# EAGLE design LAMEBOY (EAGLE 7.6.0)

## Sheet 1 of 2
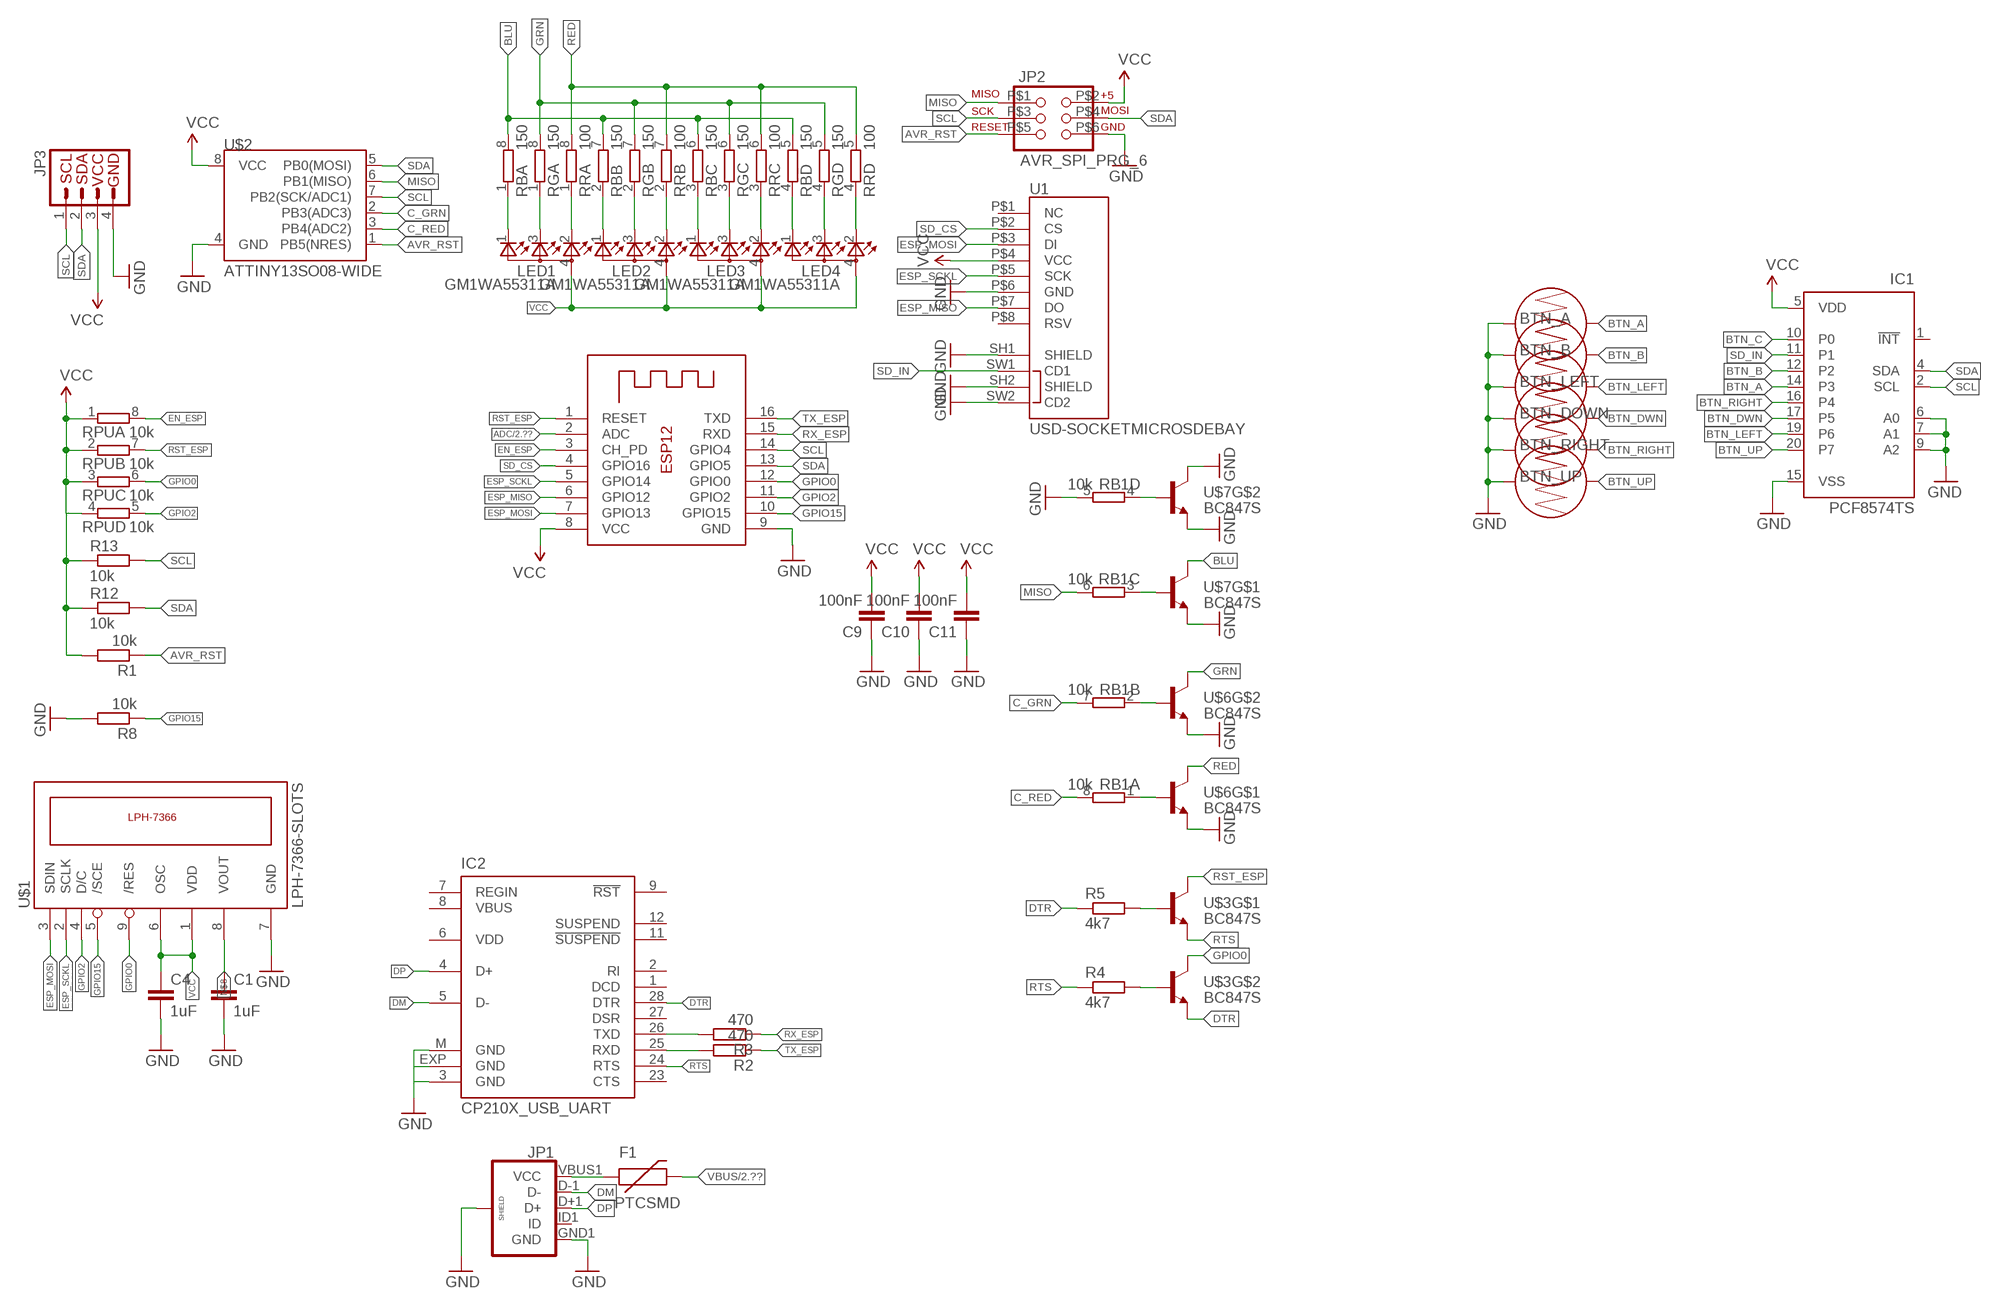
[diagram p0: schematic, sheet 1]

### Parts
BTN_A  BUTTON-CONDUCTIVESMD  [BUTTON-CONDUCTIVE]
BTN_B  BUTTON-CONDUCTIVESMD  [BUTTON-CONDUCTIVE]
BTN_DOWN  BUTTON-CONDUCTIVESMD  [BUTTON-CONDUCTIVE]
BTN_LEFT  BUTTON-CONDUCTIVESMD  [BUTTON-CONDUCTIVE]
BTN_RIGHT  BUTTON-CONDUCTIVESMD  [BUTTON-CONDUCTIVE]
BTN_UP  BUTTON-CONDUCTIVESMD  [BUTTON-CONDUCTIVE]
C1  1uF  C-EUC0805  [C0805]
C4  1uF  C-EUC0805  [C0805]
C9  100nF  C-EUC0805  [C0805]
C10  100nF  C-EUC0805  [C0805]
C11  100nF  C-EUC0805  [C0805]
F1  PTCSMD  [PTC-1206]
IC1  PCF8574TS  [SSOP20]
IC2  CP210X_USB_UART  [MLP28]
JP1  USB_MICROB_PLUG-IDK  [USB-AB-MICRO-SMD_SLOT]
JP2  AVR_SPI_PRG_6  [2X3_SMD_PAD]
JP3  I2C_STANDARDI2C_JST  [S4B-PH]
LED1  GM1WA55311A  [GM1WA55311A]
LED2  GM1WA55311A  [GM1WA55311A]
LED3  GM1WA55311A  [GM1WA55311A]
LED4  GM1WA55311A  [GM1WA55311A]
R1  10k  R-EU_R0805  [R0805]
R2  470  R-EU_R0805  [R0805]
R3  470  R-EU_R0805  [R0805]
R4  4k7  R-EU_R0805  [R0805]
R5  4k7  R-EU_R0805  [R0805]
R8  10k  R-EU_R0805  [R0805]
R12  10k  R-EU_R0805  [R0805]
R13  10k  R-EU_R0805  [R0805]
RB  150  4R-N0603-ARC  [0603-ARC]
RB1  10k  4R-N0603-ARC  [0603-ARC]
RG  150  4R-N0603-ARC  [0603-ARC]
RPU  10k  4R-N0603-ARC  [0603-ARC]
RR  100  4R-N0603-ARC  [0603-ARC]
U1  USD-SOCKETMICROSDEBAY  [MICRO-SD-SOCKET-EBAY]
U$1  LPH-7366-SLOTS  [LPH-7366-SLOTS]
U$2  ATTINY13SO08-WIDE  [SO08-EIAJ]
U$3  BC847S  MMDT3904  [SOT363]
U$6  BC847S  MMDT3904  [SOT363]
U$7  BC847S  MMDT3904  [SOT363]
X1  ESP-12  [ESP-12]

### Nets
ADC: X1.2(ADC) ; also sheet 2
AVR_RST: JP2.P$5 R1.1 U$2.1(PB5(NRES))
BLU: RB.5 RB.6 RB.7 RB.8 U$7.3(C)
BLUE_LED: LED4.1(CGREEN) RB.4
BTN_A: BTN_A.2 IC1.14(P3)
BTN_B: BTN_B.2 IC1.12(P2)
BTN_C: IC1.10(P0)
BTN_DWN: BTN_DOWN.2 IC1.17(P5)
BTN_LEFT: BTN_LEFT.2 IC1.19(P6)
BTN_RIGHT: BTN_RIGHT.2 IC1.16(P4)
BTN_UP: BTN_UP.2 IC1.20(P7)
C_GRN: RB1.7 U$2.2(PB3(ADC3))
C_RED: RB1.8 U$2.3(PB4(ADC2))
DM: IC2.5(D-) JP1.D-1(D-)
DP: IC2.4(D+) JP1.D+1(D+)
DTR: IC2.28(DTR) R5.1 U$3.1(E)
EN_ESP: RPU.8 X1.3(CH_PD)
ESP_MISO: U1.P$7(DO) X1.6(GPIO12)
ESP_MOSI: U1.P$3(DI) U$1.3(SDIN) X1.7(GPIO13)
ESP_SCKL: U1.P$5(SCK) U$1.2(SCLK) X1.5(GPIO14)
GND: BTN_A.1 BTN_B.1 BTN_DOWN.1 BTN_LEFT.1 BTN_RIGHT.1 BTN_UP.1 C1.2 C4.2 C9.1 C10.1 C11.1 IC1.6(A0) IC1.7(A1) IC1.9(A2) IC1.15(VSS) IC2.3(GND) IC2.EXP(GND) IC2.M(GND) JP1.GND1(GND) JP1.P$1(SHIELD) JP1.P$2(SHIELD) JP1.P$3(SHIELD) JP1.P$4(SHIELD) JP2.P$6 JP3.4 R8.2 RB1.5 U1.P$6(GND) U1.SH1(SHIELD) U1.SH2(SHIELD) U1.SW2(CD2) U$1.7(GND) U$2.4(GND) U$6.1(E) U$6.4(E) U$7.1(E) U$7.4(E) U$7.6(C) X1.9(GND) ; also sheet 2
GPIO0: RPU.6 U$1.9(/RES) U$3.6(C) X1.12(GPIO0)
GPIO2: RPU.5 U$1.4(D/C) X1.11(GPIO2)
GPIO15: R8.1 U$1.5(/SCE) X1.10(GPIO15)
GREEN_LED: LED4.3(CBLUE) RG.4
GRN: RG.5 RG.6 RG.7 RG.8 U$6.6(C)
L2_R: LED1.3(CBLUE) RG.1
L3_B: LED1.1(CGREEN) RB.1
L4_G: LED1.2(CRED) RR.1
MISO: JP2.P$1 RB1.6 U$2.6(PB1(MISO))
N$4: LED3.1(CGREEN) RB.3
N$5: LED3.3(CBLUE) RG.3
N$6: LED3.2(CRED) RR.3
N$7: LED2.1(CGREEN) RB.2
N$8: C1.1 U$1.8(VOUT)
N$9: LED2.3(CBLUE) RG.2
N$10: LED2.2(CRED) RR.2
N$11: RB1.1 U$6.5(B)
N$13: RB1.2 U$6.2(B)
N$16: IC2.25(RXD) R2.2
N$17: IC2.26(TXD) R3.2
N$18: RB1.3 U$7.5(B)
N$19: RB1.4 U$7.2(B)
N$25: R5.2 U$3.5(B)
N$28: R4.2 U$3.2(B)
RED: RR.5 RR.6 RR.7 RR.8 U$6.3(C)
RED_LED: LED4.2(CRED) RR.4
RST_ESP: RPU.7 U$3.3(C) X1.1(RESET)
RTS: IC2.24(RTS) R4.1 U$3.4(E)
RX_ESP: R3.1 X1.15(RXD)
SCL: IC1.2(SCL) JP2.P$3 JP3.1 R13.2 U$2.7(PB2(SCK/ADC1)) X1.14(GPIO4)
SD_CS: U1.P$2(CS) X1.4(GPIO16)
SD_IN: IC1.11(P1) U1.SW1(CD1)
SDA: IC1.4(SDA) JP2.P$4 JP3.2 R12.2 U$2.5(PB0(MOSI)) X1.13(GPIO5)
TX_ESP: R2.1 X1.16(TXD)
VBUS: F1.2 ; also sheet 2
VCC: C4.1 C9.2 C10.2 C11.2 IC1.5(VDD) JP2.P$2 JP3.3 LED1.4(A) LED2.4(A) LED3.4(A) LED4.4(A) R1.2 R12.1 R13.1 RPU.1 RPU.2 RPU.3 RPU.4 U1.P$4(VCC) U$1.1(VDD) U$1.6(OSC) U$2.8(VCC) X1.8(VCC) ; also sheet 2
VUSB: F1.1 JP1.VBUS1(VCC)
Unconnected: IC1.1(!INT) IC2.1(DCD) IC2.2(RI) IC2.7(REGIN) IC2.8(VBUS) IC2.9(!RST) IC2.11(!SUSPEND) IC2.12(SUSPEND) IC2.23(CTS) IC2.27(DSR) JP1.ID1(ID) U1.P$1(NC) U1.P$8(RSV)

## Sheet 2 of 2
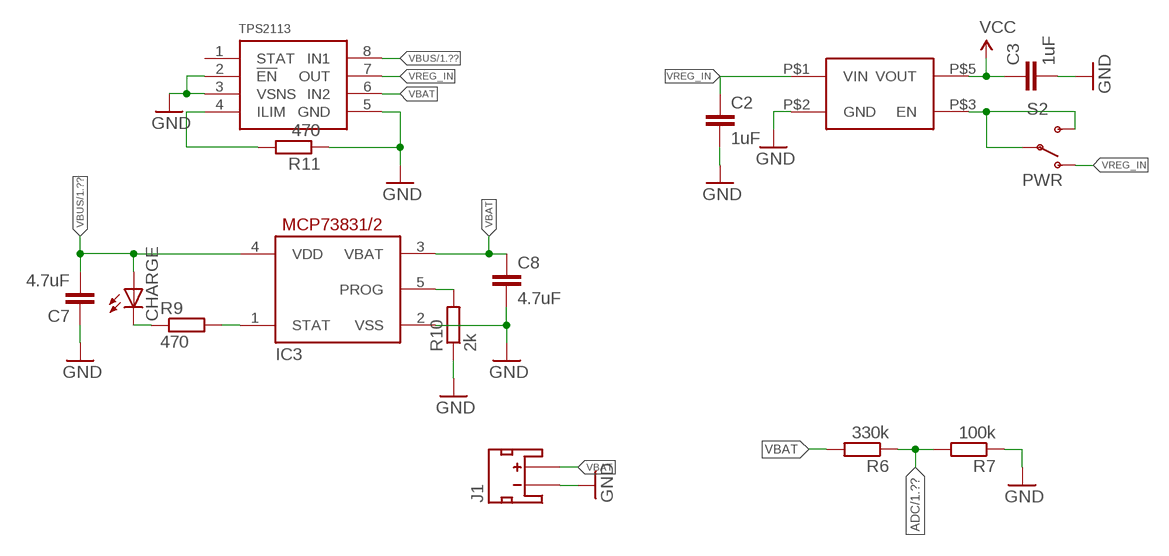
[diagram p1: schematic, sheet 2]

### Parts
C2  1uF  C-EUC0805  [C0805]
C3  1uF  C-EUC0805  [C0805]
C7  4.7uF  C-EUC0805  [C0805]
C8  4.7uF  C-EUC0805  [C0805]
CHARGE  LEDCHARLIE  [CHIPLED_0603_CHARLIE]
IC3  MCP73831  MCP73831/OT  [SOT23-5L]
J1  JST_2MM_MALE  [JST-2-SMD]
R6  330k  R-EU_R0805  [R0805]
R7  100k  R-EU_R0805  [R0805]
R9  470  R-EU_R0805  [R0805]
R10  2k  R-EU_R0805  [R0805]
R11  470  R-EU_M0805  [M0805]
S2  PWR  SWITCH-SPDT-SMD-A  [SWITCH-SPST-SMD-A]
U$4  TPS2113-PW  [TEXAS-PW]
U$9  AP2112KAP2112K  [AP2112]

### Nets
ADC: R6.1 R7.2 ; also sheet 1
GND: C2.2 C3.2 C7.1 C8.2 IC3.2(VSS) J1.1(-) R7.1 R10.1 R11.1 U$4.2(!EN) U$4.3(VSNS) U$4.5(GND) U$9.P$2(GND) ; also sheet 1
N$12: IC3.1(STAT) R9.2
N$15: CHARGE.C R9.1
N$20: R11.2 U$4.4(ILIM)
N$21: IC3.5(PROG) R10.2
VBAT: C8.1 IC3.3(VBAT) J1.2(+) R6.2 U$4.6(IN2)
VBUS: C7.2 CHARGE.A IC3.4(VDD) U$4.8(IN1) ; also sheet 1
VCC: C3.1 U$9.P$5(VOUT) ; also sheet 1
VREG_EN: S2.2(P) S2.3(S) U$9.P$3(EN)
VREG_IN: C2.1 S2.1(O) U$4.7(OUT) U$9.P$1(VIN)
Unconnected: J1.NC1(PAD1) J1.NC2(PAD2) U$4.1(STAT)

## Power pins joined to a net without a drawn wire
VDD: IC2.6(VDD)

## Library data of the parts
BTN_A BTN_B BTN_DOWN BTN_LEFT BTN_RIGHT BTN_UP = SparkFun-Electromechanical:BUTTON-CONDUCTIVE: Used with rubber key pads. This one was designed and proven to work with the PolyCase Key FOB enclosures.
C1-C4 C7-C11 = rcl:C-EU: CAPACITOR, European symbol
CHARGE = led:LED: LED OSRAM: - CHIPLED LG R971, LG N971, LY N971, LG Q971, LY Q971, LO R971, LY R971 LH N974, LH R974 LS Q976, LO Q976, LY Q976 LO Q996 - Hyper CHIPLED LW Q18S LB Q993, LB Q99A, LB R99A - SideLED LS A670, LO A670, LY A670, LG A670, LP A670 LB A673, LV A673, LT A673, LW A673 LH A674 LY A675 LS A676, LA A676, LO A676, LY A676, LW A676 LS A679, LY A679, LG A679 - Hyper Micro SIDELED® LS Y876, LA Y876, LO Y876, LY Y876 LT Y87S - SmartLED LW L88C, LW L88S LB L89C, LB L89S, LG L890 LS L89K, LO L89K, LY L89K LS L896, LA L896, LO L896, LY L896 - TOPLED LS T670, LO T670, LY T670, LG T670, LP T670 LSG T670, LSP T670, LSY T670, LOP T670, LYG T670 LG T671, LOG T671, LSG T671 LB T673, LV T673, LT T673, LW T673 LH T674 LS T676, LA T676, LO T676, LY T676, LB T676, LH T676, LSB T676, LW T676 LB T67C, LV T67C, LT T67C, LS T67K, LO T67K, LY T67K, LW E67C LS E67B, LA E67B, LO E67B, LY E67B, LB E67C, LV E67C, LT E67C LW T67C LS T679, LY T679, LG T679 LS T770, LO T770, LY T770, LG T770, LP T770 LB T773, LV T773, LT T773, LW T773 LH T774 LS E675, LA E675, LY E675, LS T675 LS T776, LA T776, LO T776, LY T776, LB T776 LHGB T686 LT T68C, LB T68C - Hyper Mini TOPLED® LB M676 - Mini TOPLED Santana® LG M470 LS M47K, LO M47K, LY M47K Source: http://www.osram.convergy.de LUXEON: - LUMILED® LXK2-PW12-R00, LXK2-PW12-S00, LXK2-PW14-U00, LXK2-PW14-V00 LXK2-PM12-R00, LXK2-PM12-S00, LXK2-PM14-U00 LXK2-PE12-Q00, LXK2-PE12-R00, LXK2-PE12-S00, LXK2-PE14-T00, LXK2-PE14-U00 LXK2-PB12-K00, LXK2-PB12-L00, LXK2-PB12-M00, LXK2-PB14-N00, LXK2-PB14-P00, LXK2-PB14-Q00 LXK2-PR12-L00, LXK2-PR12-M00, LXK2-PR14-Q00, LXK2-PR14-R00 LXK2-PD12-Q00, LXK2-PD12-R00, LXK2-PD12-S00 LXK2-PH12-R00, LXK2-PH12-S00 LXK2-PL12-P00, LXK2-PL12-Q00, LXK2-PL12-R00 Source: www.luxeon.com KINGBRIGHT: KA-3528ASYC Source: www.kingbright.com
F1 = SparkFun-PowerIC:PTC: Resettable Fuse PTC Resettable Fuse. Spark Fun Electronics SKU : COM-08357; PROD_ID: RES-11150
IC1 = micro-philips:PCF8574: I2C-Bus Remote 8-bit I/O expander http://www.semiconductors.philips.com/acrobat_download/datasheets/PCF8574_4.pdf; MPN: PCF8574TS/3,118; OC_FARNELL: 1506644; OC_NEWARK: 70R6873
IC2 = SparkFun-DigitalIC:CP210X_USB_UART: Single-Chip USB to UART Bridge Source: www.silabs.com .. CP2101.pdf / cp2102.pdf. Spark Fun Electronics SKU : COM-00310
IC3 = adafruit:MCP73831: MCP73831/2 Miniature Single-Cell, Fully Integrated Li-Ion, Li-Polymer Charge Management Controllers. Nice and small simple lipoly charge controller, with adjustable current and status output (LED) http://www.ladyada.net/library/pcb/eaglelibrary.html
J1 = SparkFun-Connectors:JST_2MM_MALE: Mates to single-cell LiPo batteries. CONN-08352; PROD_ID: CONN-08352
JP1 = SparkFun-Connectors:USB_MICROB_PLUG: USB Micro-B connectors Some male, some female. Watch your step!
JP2 = SparkFun-Connectors:AVR_SPI_PRG_6: AVR ISP 6 Pin This is the reduced ISP connector for AVR programming. Common on Arduino. This footprint will take up less PCB space and can be used with a 10-pin to 6-pin adapter such as SKU: BOB-08508 **Special note about "TEST_POINT" package. The stop mask is on the top side, so if you want your programming test points to be on the bottom of your board, make sure to place this package on the bottom side of the board. This also ensure that the orientation to program from the bottom side will be correct.
JP3 = SparkFun-Connectors:I2C_STANDARD: SparkFun has standardized on a pinout for all I2C based sensor breakouts. This pinout allows I2C boards to be plugged directly into the headers on Arduino Uno compatible boards, and to be daisy chained easily.
LED1-LED4 = led:GM1WA55311A: Chip LED RGB Source: http://document.sharpsma.com/files/GM1WA55311A_SS.pdf
R1-R10 R12 R13 = rcl:R-EU_: RESISTOR, European symbol
R11 = resistor:R-EU_: RESISTOR, European symbol
RB RB1 RG RPU RR = resistor-dil:4R-N: Array Chip Resistor Source: RS Component / Phycomp; OC_FARNELL: unknown; OC_NEWARK: unknown
S2 = SparkFun-Electromechanical:SWITCH-SPDT: SPDT Switch Simple slide switch, Spark Fun Electronics SKU : COM-00102 DPDT SMT slide switch, AYZ0202, SWCH-08179
U1 = SparkFun-Connectors:USD-SOCKET: microSD Socket Push-push type uSD socket. Schematic element and footprint production proven. Spark Fun Electronics SKU : PRT-00127. tDoc lines correctly indicate media card edge positions when inserting (unlocked, locked, depressed). NOTE: CD1 and CD2 are connected internally
U$1 = lph-7366:LPH-7366-SLOTS
U$2 = SparkFun-DigitalIC:ATTINY13: Atmel 8-pin 1kB flash uC
U$3 U$6 U$7 = SparkFun-DiscreteSemi:MMDT3904: Dual NPN transistor
U$4 = TPS2113:TPS2113-PW
U$9 = TPS2113:AP2112K
X1 = adafruit:ESP-12

## Board
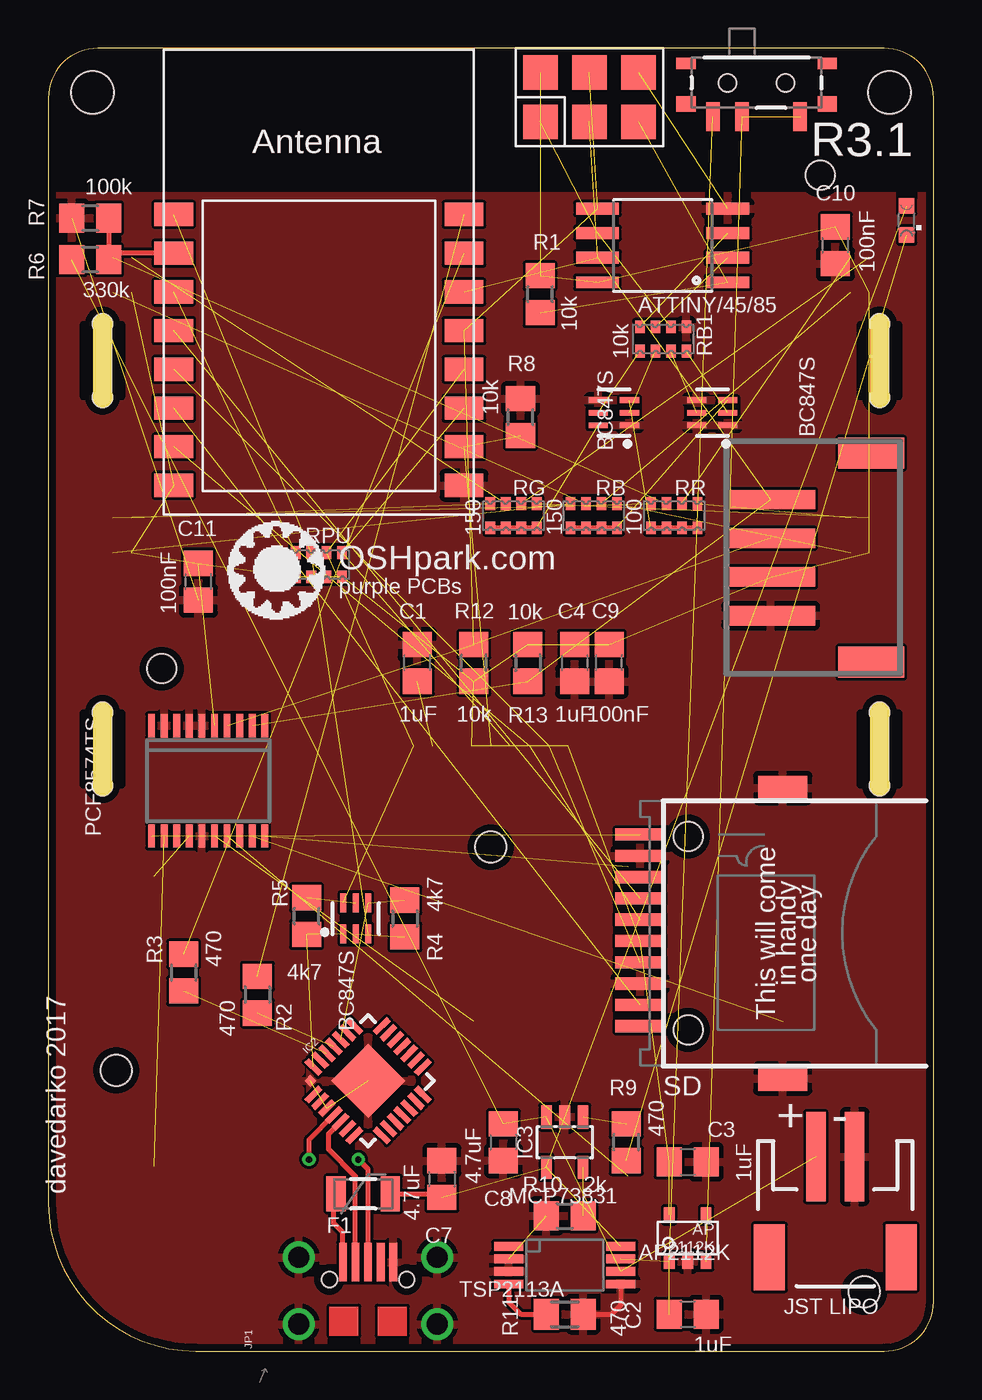
[diagram p2: board, top side]
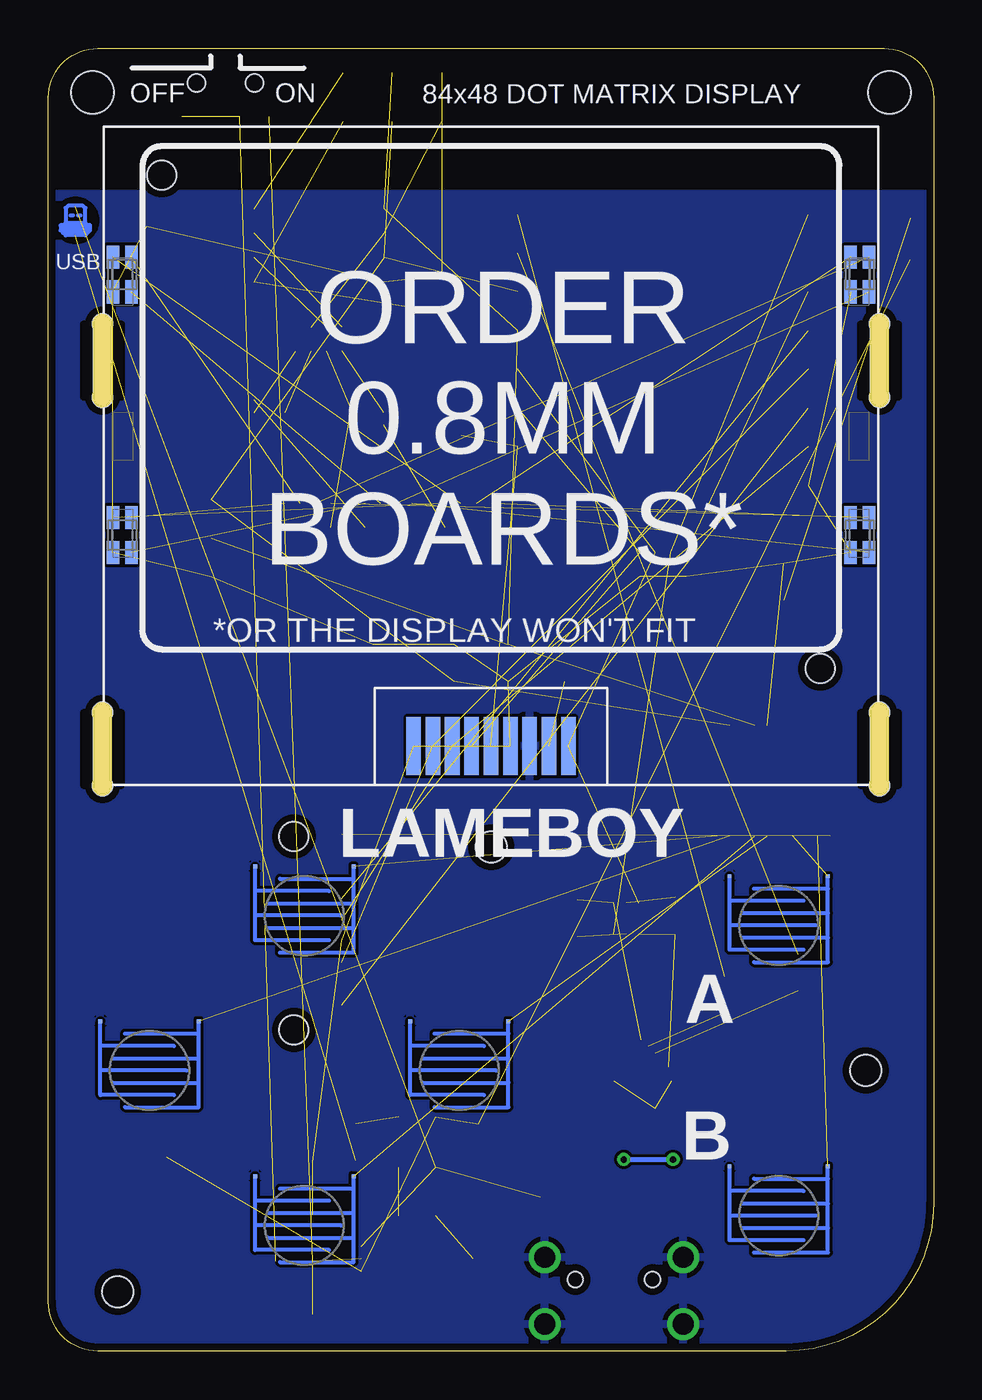
[diagram p3: board, bottom side, seen from below]

Size 45.72 x 67.31 mm. Coordinates in mm from the lower left corner, seen from the top.
Outline: 0,64.77 0,7.62 arc90 7.62,0 43.18,0 arc90 45.72,2.54 45.72,64.77 arc90 43.18,67.31 2.54,67.31 arc90 0,64.77
Copper layers (1*16): Top 0.0356mm / dielectric 1.5011mm / Bottom 0.0356mm
Design rules "LaenPCBOrder *": minimum track width 6mil, minimum drill 13mil, track to track 6mil, track to pad 6mil, pad to pad 6mil, via to via 6mil, smd to smd 6mil, copper to edge 15mil, drill to drill 6mil, minimum pad ring 7mil, minimum via ring 7mil, stop-mask expansion 3mil, vias tented up to drill 200mil, thermal gap 10mil
Holes 2.2 mm at 2.29,65.02 43.43,65.02
Holes 1.6 mm at 3.5,14.5 42.13,3.06 22.85,26.04

### Footprints (pad centres in the part's own frame; a part is rotated, then mirrored left to right if it is on the bottom)
BUTTON-CONDUCTIVE = smd 0.203 x 0.203: 1 2.54,2.54; 2 2.54,-2.54
C0805 = smd 1.3 x 1.5: 1 -0.95,0; 2 0.95,0
CHIPLED_0603_CHARLIE = smd 0.8 x 0.8: A 0,-0.75; C 0,0.75
PTC-1206 = smd 1 x 1.8: 1 -1.4,0; 2 1.4,0
SSOP20 = smd 0.35 x 1.2: 1 -2.925,-2.85; 2 -2.275,-2.85; 3 -1.625,-2.85; 4 -0.975,-2.85; 5 -0.325,-2.85; 6 0.325,-2.85; 7 0.975,-2.85; 8 1.625,-2.85; 9 2.275,-2.85; 10 2.925,-2.85; 11 2.925,2.85; 12 2.275,2.85; 13 1.625,2.85; 14 0.975,2.85; 15 0.325,2.85; 16 -0.325,2.85; 17 -0.975,2.85; 18 -1.625,2.85; 19 -2.275,2.85; 20 -2.925,2.85
MLP28 = smd 1 x 0.3: 1 -2.5,1.5; 2 -2.5,1; 3 -2.5,0.5; 4 -2.5,0; 5 -2.5,-0.5; 6 -2.5,-1; 7 -2.5,-1.5; 15 2.5,-1.5; 16 2.5,-1; 17 2.5,-0.5; 18 2.5,0; 19 2.5,0.5; 20 2.5,1; 21 2.5,1.5 | smd 0.3 x 1: 8 -1.5,-2.5; 9 -1,-2.5; 10 -0.5,-2.5; 11 0,-2.5; 12 0.5,-2.5; 13 1,-2.5; 14 1.5,-2.5; 22 1.5,2.5; 23 1,2.5; 24 0.5,2.5; 25 0,2.5; 26 -0.5,2.5; 27 -1,2.5; 28 -1.5,2.5 | smd 2.7 x 2.7: EXP 0,0 | smd 0.435 x 0.435: M -2.103,2.103
SOT23-5L = smd 0.55 x 1.2: 1 -0.95,-1.3; 2 0,-1.3; 3 0.95,-1.3; 4 0.95,1.3; 5 -0.95,1.3
JST-2-SMD = smd 1 x 4.6: 1 -1,-3.7; 2 1,-3.7 | smd 1.6 x 3.4: NC1 -3.4,1.5; NC2 3.4,1.5
USB-AB-MICRO-SMD_SLOT = smd 2 x 0.4: D+1 3.2,0; D-1 3.2,0.65; GND1 3.2,-1.3; ID1 3.2,-0.65; VBUS1 3.2,1.3 | drill 1.1: P$1 0,3.575; P$2 0,-3.575; P$3 3.45,-3.575; P$4 3.45,3.575 | hole 0.8: 2.3,2; 2.3,-2
2X3_SMD_PAD = smd 1.778 x 1.778: P$1 -1.27,2.54; P$2 1.27,2.54; P$3 -1.27,0; P$4 1.27,0; P$5 -1.27,-2.54; P$6 1.27,-2.54
S4B-PH = smd 1 x 4.6: 1 -3,-4.7; 2 -1,-4.7; 3 1,-4.7; 4 3,-4.7 | smd 1.6 x 3.4: P$1 -5.4,0.5; P$2 5.4,0.5
GM1WA55311A = smd 0.65 x 1.2: 1 -0.475,0.9; 2 -0.475,-0.9; 3 0.475,-0.9; 4 0.475,0.9
R0805 = smd 1.3 x 1.5: 1 -0.95,0; 2 0.95,0
M0805 = smd 1.3 x 1.6: 1 -0.95,0; 2 0.95,0
0603-ARC = smd 0.5 x 0.65: 1 -1.2,-0.625; 2 -0.4,-0.625; 3 0.4,-0.625; 4 1.2,-0.625; 5 1.2,0.625; 6 0.4,0.625; 7 -0.4,0.625; 8 -1.2,0.625
SWITCH-SPST-SMD-A = smd 0.7 x 1.5: 1 -2.25,-1.75; 2 -0.75,-1.75; 3 2.25,-1.75 | smd 1 x 0.6: GND1 -3.65,1; GND3 3.65,1 | smd 1 x 0.8: GND2 -3.65,-1.1; GND4 3.65,-1.1 | hole 0.9: -1.5,0; 1.5,0
MICRO-SD-SOCKET-EBAY = smd 0.63 x 2.54: P$1 -2.9,-5; P$2 -1.8,-5; P$4 0.4,-5; P$5 1.5,-5; P$6 2.6,-5; P$7 3.7,-5; P$8 4.8,-5; SW1 -5.1,-5; SW2 -4,-5 | smd 0.635 x 2.54: P$3 -0.7,-5 | smd 1.27 x 2.54: SH1 -7.5,2.37; SH2 7.5,2.37 | hole 1.5: -5,-2.52; 5,-2.52
LPH-7366-SLOTS = smd 0.75 x 3: 1 4,17; 2 3,17; 3 2,17; 4 1,17; 5 0,17; 6 -1,17; 7 -2,17; 8 -3,17; 9 -4,17 | hole 1.5: -17,13; 17,-12.5 | hole 1.016: -20.066,19.05; -20.066,15.24; 20.066,19.05; 20.066,15.24; 20.066,-1.016; 20.066,-4.826; -20.066,-1.016; -20.066,-4.826
SO08-EIAJ = smd 0.61 x 2.21: 1 -1.905,-3.378; 2 -0.635,-3.378; 3 0.635,-3.378; 4 1.905,-3.378; 5 1.905,3.353; 6 0.635,3.353; 7 -0.635,3.353; 8 -1.905,3.353
SOT363 = smd 0.3 x 0.99: 1 -0.65,-0.8; 2 0,-0.8; 3 0.65,-0.8; 4 0.65,0.81; 5 0,0.81; 6 -0.65,0.81
TEXAS-PW = smd 1.5 x 0.45: 1 -2.9,0.975; 2 -2.9,0.325; 3 -2.9,-0.325; 4 -2.9,-0.975; 5 2.9,-0.975; 6 2.9,-0.325; 7 2.9,0.325; 8 2.9,0.975
AP2112 = smd 0.55 x 0.8: P$1 0.95,1.2; P$2 0,1.2; P$3 -0.95,1.2; P$4 -0.95,-1.2; P$5 0.95,-1.2
ESP-12 = smd 2 x 1.2: 1 -7.5,4.5; 2 -7.5,2.5; 3 -7.5,0.5; 4 -7.5,-1.5; 5 -7.5,-3.5; 6 -7.5,-5.5; 7 -7.5,-7.5; 8 -7.5,-9.5; 9 7.5,-9.5; 10 7.5,-7.5; 11 7.5,-5.5; 12 7.5,-3.5; 13 7.5,-1.5; 14 7.5,0.5; 15 7.5,2.5; 16 7.5,4.5

### Placement (x,y rotation side)
BTN_A  8,22 90 bottom
BTN_B  8,7 90 bottom
BTN_DOWN  32.5,6.5 90 bottom
BTN_LEFT  40.5,14.5 90 bottom
BTN_RIGHT  24.5,14.5 90 bottom
BTN_UP  32.5,22.5 90 bottom
C1  19.05,35.56 90 top
C2  33.02,1.91 0 top
C3  33.02,9.78 0 top
C4  27.18,35.56 270 top
C7  20.32,8.89 270 top
C8  23.5,10.79 270 top
C9  28.96,35.56 90 top
C10  40.65,57.14 90 top
C11  7.75,39.75 90 top
CHARGE  44.32,58.42 180 top
F1  16.26,8.13 0 top
IC1  8.26,29.46 180 top
IC2  16.51,13.97 45 top
IC3  26.67,10.79 180 top
J1  40.64,6.35 180 top
JP1  16.51,1.4 90 top
JP2  27.95,64.79 90 top
JP3  42,41 270 top
LED1  41.91,42.16 180 bottom
LED2  41.91,55.63 180 bottom
LED3  3.81,55.63 180 bottom
LED4  3.81,42.16 180 bottom
R1  25.4,54.61 90 top
R2  10.79,18.41 270 top
R3  6.99,19.56 270 top
R4  18.41,22.35 270 top
R5  13.34,22.48 90 top
R6  2.16,56.39 180 top
R7  2.16,58.55 0 top
R8  24.38,48.26 90 top
R9  29.84,10.79 90 top
R10  26.67,6.99 0 top
R11  26.67,1.91 180 top
R12  21.97,35.56 90 top
R13  24.77,35.56 270 top
RB  28.17,43.17 180 top
RB1  31.75,52.29 0 top
RG  24.02,43.17 180 top
RPU  13.97,40.64 0 top
RR  32.32,43.17 180 top
S2  36.58,65.53 0 top
U1  35.56,21.59 270 top
U$1  22.86,48.26 180 bottom
U$2  31.72,57.13 90 top
U$3  15.88,22.35 0 top
U$4  26.67,4.45 0 top
U$5  [OSHPARK_LOGO]  20.7,40.39 0 top
U$6  29.21,48.48 90 top
U$7  34.29,48.48 90 top
U$9  33.02,5.84 180 top
X1  13.97,54.23 0 top

### Tracks (layer width: path | path; a pad name or v marks a point on that pad's centre or on a via)
ADC
  Top 0.254: R7.2 R6.1 3.45,56.73 X1.2
AVR_RST  (2 unrouted)
BLU  (1 unrouted)
  Top 0.254: RB.5 RB.6 RB.7 RB.8
BLUE_LED  (1 unrouted)
BTN_A  (1 unrouted)
BTN_B  (1 unrouted)
BTN_DWN  (1 unrouted)
BTN_LEFT  (1 unrouted)
BTN_RIGHT  (1 unrouted)
BTN_UP  (1 unrouted)
C_GRN  (1 unrouted)
C_RED  (1 unrouted)
DM
  Top 0.254: JP1.D-1 15.86,9.03 14.48,10.41 14.48,11.23 IC2.5
DP  (via drill 0.33)
  Top 0.254: JP1.D+1 16.51,9.4 v16,9.91 | v13.46,9.91 13.46,10.92 IC2.4
  Bottom 0.254: v16,9.91 v13.46,9.91
DTR  (2 unrouted)
EN_ESP  (1 unrouted)
ESP_MISO  (1 unrouted)
ESP_MOSI  (2 unrouted)
ESP_SCKL  (2 unrouted)
GND  (5 unrouted)
  Top 0.254: R11.1 29.08,1.91 29.59,2.41 29.59,3.45 U$4.5
  pour Bottom (isolate 0.152): -2.54,59.77 48.26,59.77 48.26,-5.08 -2.54,-5.08
  pour Top (isolate 0.152): -3.81,59.69 49.53,59.69 49.53,-2.54 -3.81,-2.54
GPIO0  (3 unrouted)
GPIO2  (2 unrouted)
GPIO15  (2 unrouted)
GREEN_LED  (1 unrouted)
GRN  (1 unrouted)
  Top 0.254: RG.5 RG.6 RG.7 RG.8
L2_R  (1 unrouted)
L3_B  (1 unrouted)
L4_G  (1 unrouted)
MISO  (2 unrouted)
N$1
  Bottom 0.203: 43.94,59.18 44.7,59.18 44.83,59.05 44.83,58.29 43.81,58.29 43.81,59.05 43.94,59.18
N$2
  Bottom 0.203: 44.07,58.67 44.2,58.67
N$3
  Bottom 0.203: 44.45,58.67 44.58,58.67
N$4  (1 unrouted)
N$5  (1 unrouted)
N$6  (1 unrouted)
N$7  (1 unrouted)
N$8  (1 unrouted)
N$9  (1 unrouted)
N$10  (1 unrouted)
N$11  (1 unrouted)
N$12  (1 unrouted)
N$13  (1 unrouted)
N$14
  Bottom 0.152: 44.83,57.91 44.83,57.66
  Bottom 0.203: 43.69,58.04 44.96,58.04 44.96,57.78 43.69,57.78 43.69,57.91 44.83,57.91 | 43.56,57.91 43.56,58.17 45.09,58.17 45.09,57.91 44.83,57.66 43.81,57.66 43.56,57.91
N$15  (1 unrouted)
N$16  (1 unrouted)
N$17  (1 unrouted)
N$18  (1 unrouted)
N$19  (1 unrouted)
N$20
  Top 0.254: U$4.4 23.77,2.52 24.38,1.91 R11.2
N$21  (1 unrouted)
N$25  (1 unrouted)
N$28  (1 unrouted)
RED  (1 unrouted)
  Top 0.254: RR.5 RR.6 RR.7 RR.8
RED_LED  (1 unrouted)
RST_ESP  (2 unrouted)
RTS  (2 unrouted)
RX_ESP  (1 unrouted)
SCL  (5 unrouted)
SD_CS  (1 unrouted)
SD_IN  (1 unrouted)
SDA  (5 unrouted)
TX_ESP  (1 unrouted)
VBAT  (4 unrouted)
VBUS  (3 unrouted)
  Top 0.254: F1.2 19.81,8.13 20.32,7.62 C7.2
VCC  (24 unrouted)
VREG_EN  (2 unrouted)
VREG_IN  (3 unrouted)
VUSB
  Top 0.254: JP1.VBUS1 15.21,6.13 14.73,6.6 14.73,8 F1.1

### Text on the board
tNames: R3.1 | ATTINY/45/85 | BC847S | BC847S | This will come / in handy / one day | BC847S | SD | + - | davedarko 2017 | AP2112K | TSP2113A | JST LIPO
bNames: ON | OFF | 84x48 DOT MATRIX DISPLAY | USB | ORDER / 0.8MM / BOARDS* | *OR THE DISPLAY WON'T FIT | LAMEBOY | A | B